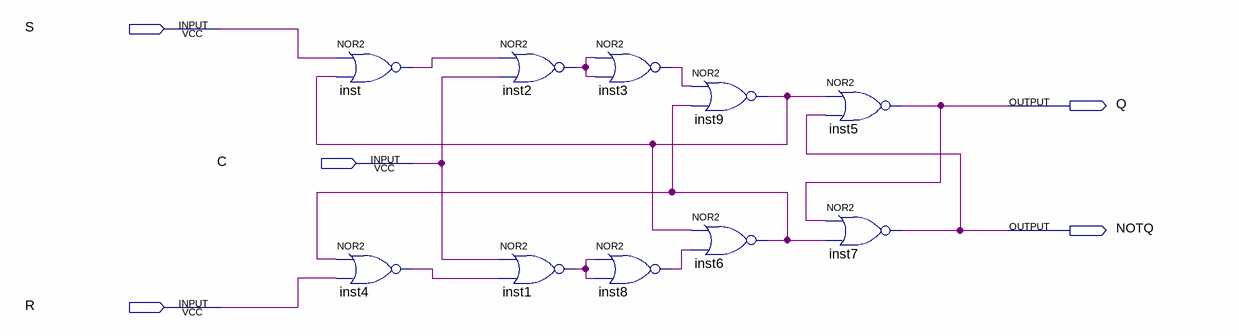
[diagram p0: schematic sheet]
// Quartus schematic lab_5_3.bdf as structural Verilog: 10 symbols, 5 pins
module lab_5_3 (
  input  S,
  input  C,
  input  R,
  output Q,
  output NOTQ
);

  wire inst1_out, inst2_out, inst3_out, inst4_out, inst6_out, inst8_out, inst9_out, inst_out;

  nor inst (inst_out, S, inst9_out);
  nor inst4 (inst4_out, inst6_out, R);
  nor inst2 (inst2_out, inst_out, C);
  nor inst1 (inst1_out, C, inst4_out);
  nor inst3 (inst3_out, inst2_out, inst2_out);
  nor inst8 (inst8_out, inst1_out, inst1_out);
  nor inst9 (inst9_out, inst3_out, inst6_out);
  nor inst6 (inst6_out, inst9_out, inst8_out);
  nor inst5 (Q, inst9_out, NOTQ);
  nor inst7 (NOTQ, Q, inst6_out);
endmodule
